# Altium schematic sheet Block Diagram.SchDoc: Block Diagram
size A4; Organization: Energy Auditor; Address1: Sensor Node; Address3: University of Colorado; Address4: Boulder; DocumentNumber: 1; Revision: 1; SheetNumber: 1; SheetTotal: 6
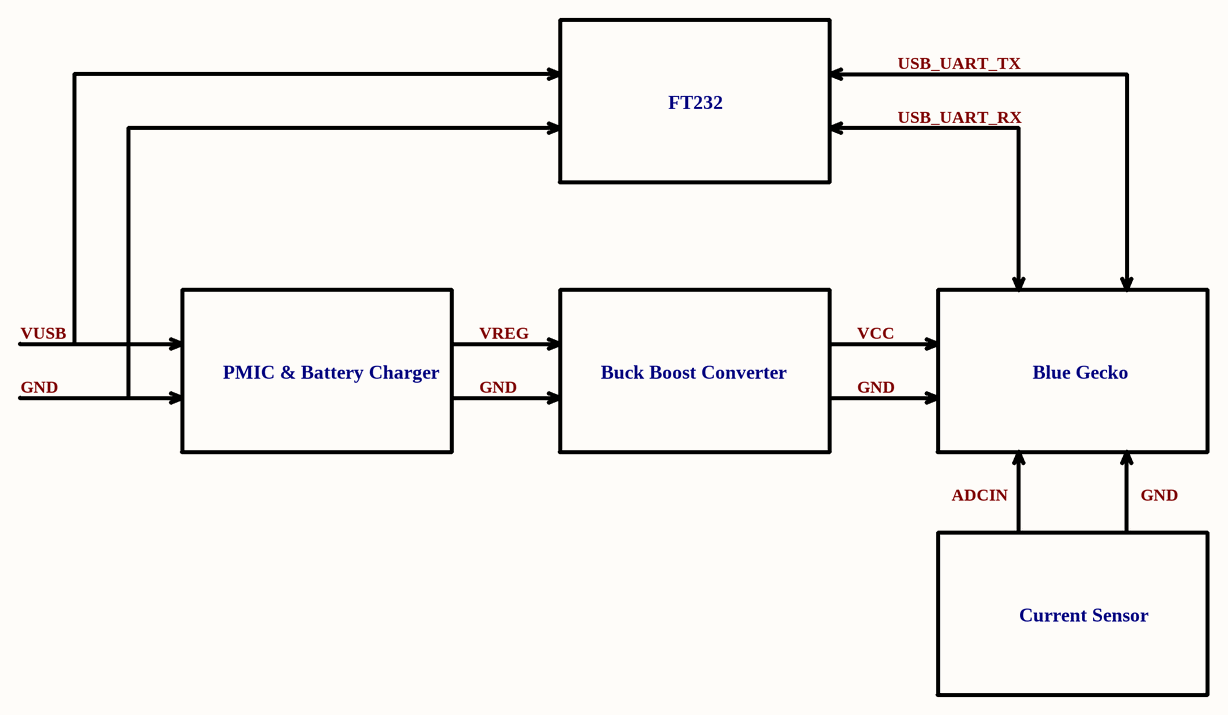
[diagram p0: Block Diagram.SchDoc]

## Notes on the sheet
- FT232
- USB_UART_TX
- USB_UART_RX
- VUSB
- GND
- PMIC & Battery Charger
- VREG
- Buck Boost Converter
- VCC
- Blue Gecko
- ADCIN
- Current Sensor
- Title
- Size:
- Date:
- A4
- Number:
- Time:
- Revision:
- Sheet
- of
- File: